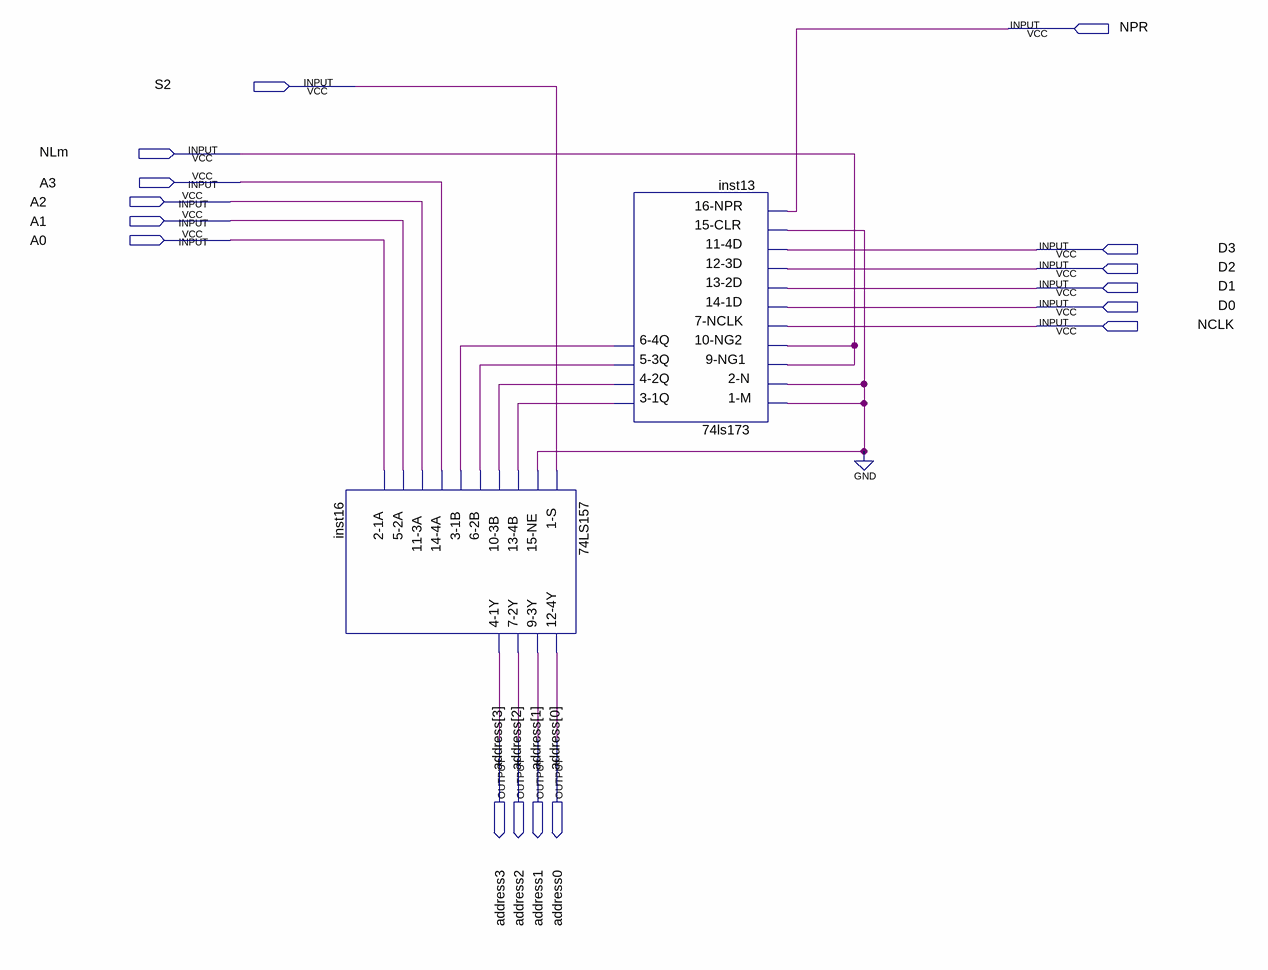
[diagram p0: schematic sheet]
// Quartus schematic REM.bdf as structural Verilog: 2 symbols, 16 pins
module REM (
  input  NPR,
  input  S2,
  input  NLm,
  input  A3,
  input  A2,
  input  A1,
  input  A0,
  input  D3,
  input  D2,
  input  D1,
  input  D0,
  input  NCLK,
  output address3,
  output address2,
  output address1,
  output address0
);

  wire inst13_3_1q, inst13_4_2q, inst13_5_3q, inst13_6_4q;

  \74LS157  inst16 (
    .\1-S (S2), .\15-NE (1'b0), .\13-4B (inst13_3_1q), .\10-3B (inst13_4_2q), .\6-2B (inst13_5_3q),
    .\3-1B (inst13_6_4q), .\14-4A (A3), .\11-3A (A2), .\5-2A (A1), .\2-1A (A0), .\12-4Y (address0),
    .\9-3Y (address1), .\7-2Y (address2), .\4-1Y (address3));
  \74ls173  inst13 (
    .\1-M (1'b0), .\2-N (1'b0), .\9-NG1 (NLm), .\10-NG2 (NLm), .\7-NCLK (NCLK), .\14-1D (D0), .\13-2D (D1),
    .\12-3D (D2), .\11-4D (D3), .\15-CLR (1'b0), .\16-NPR (NPR), .\3-1Q (inst13_3_1q), .\4-2Q (inst13_4_2q),
    .\5-3Q (inst13_5_3q), .\6-4Q (inst13_6_4q));
endmodule
